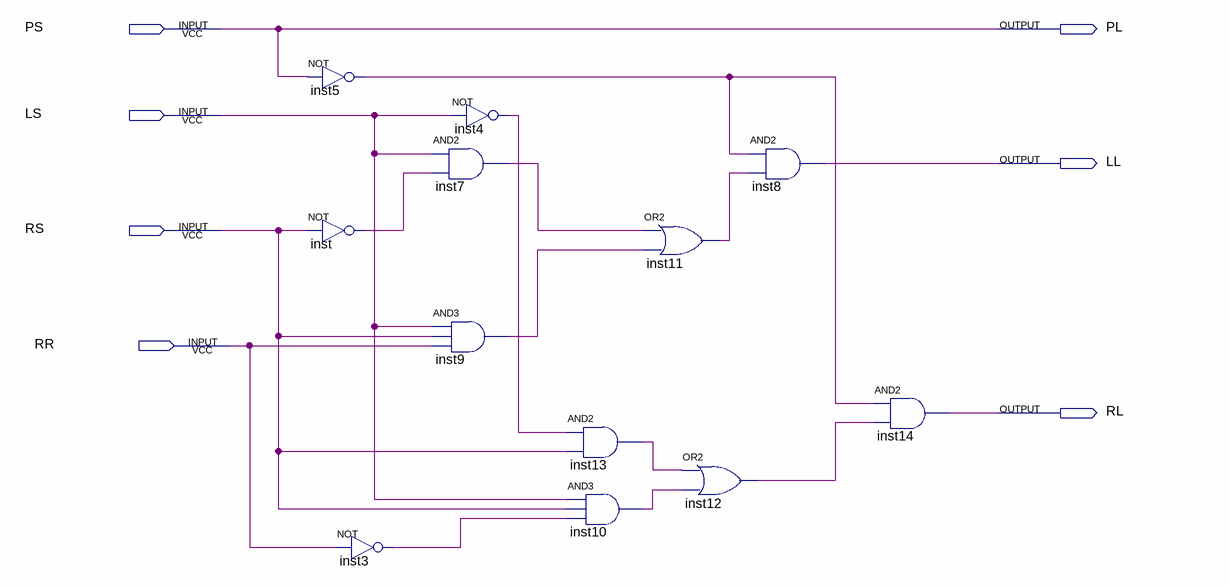
[diagram p0: schematic sheet]
// Quartus schematic B0729056_LAB1_2.bdf as structural Verilog: 12 symbols, 7 pins
module B0729056_LAB1_2 (
  input  PS,
  input  LS,
  input  RS,
  input  RR,
  output PL,
  output LL,
  output RL
);

  wire inst3_out, inst4_out, inst5_out, inst7_out, inst9_out, inst10_out, inst11_out, inst12_out, inst13_out,
       inst_out;

  not inst5 (inst5_out, PS);
  not inst (inst_out, RS);
  not inst3 (inst3_out, RR);
  not inst4 (inst4_out, LS);
  and inst7 (inst7_out, LS, inst_out);
  and inst9 (inst9_out, LS, RS, RR);
  and inst13 (inst13_out, inst4_out, RS);
  and inst10 (inst10_out, LS, RS, inst3_out);
  or inst11 (inst11_out, inst7_out, inst9_out);
  or inst12 (inst12_out, inst13_out, inst10_out);
  and inst8 (LL, inst5_out, inst11_out);
  and inst14 (RL, inst5_out, inst12_out);

  assign PL = PS;
endmodule
